# EAGLE design sch (EAGLE 8.6.0)
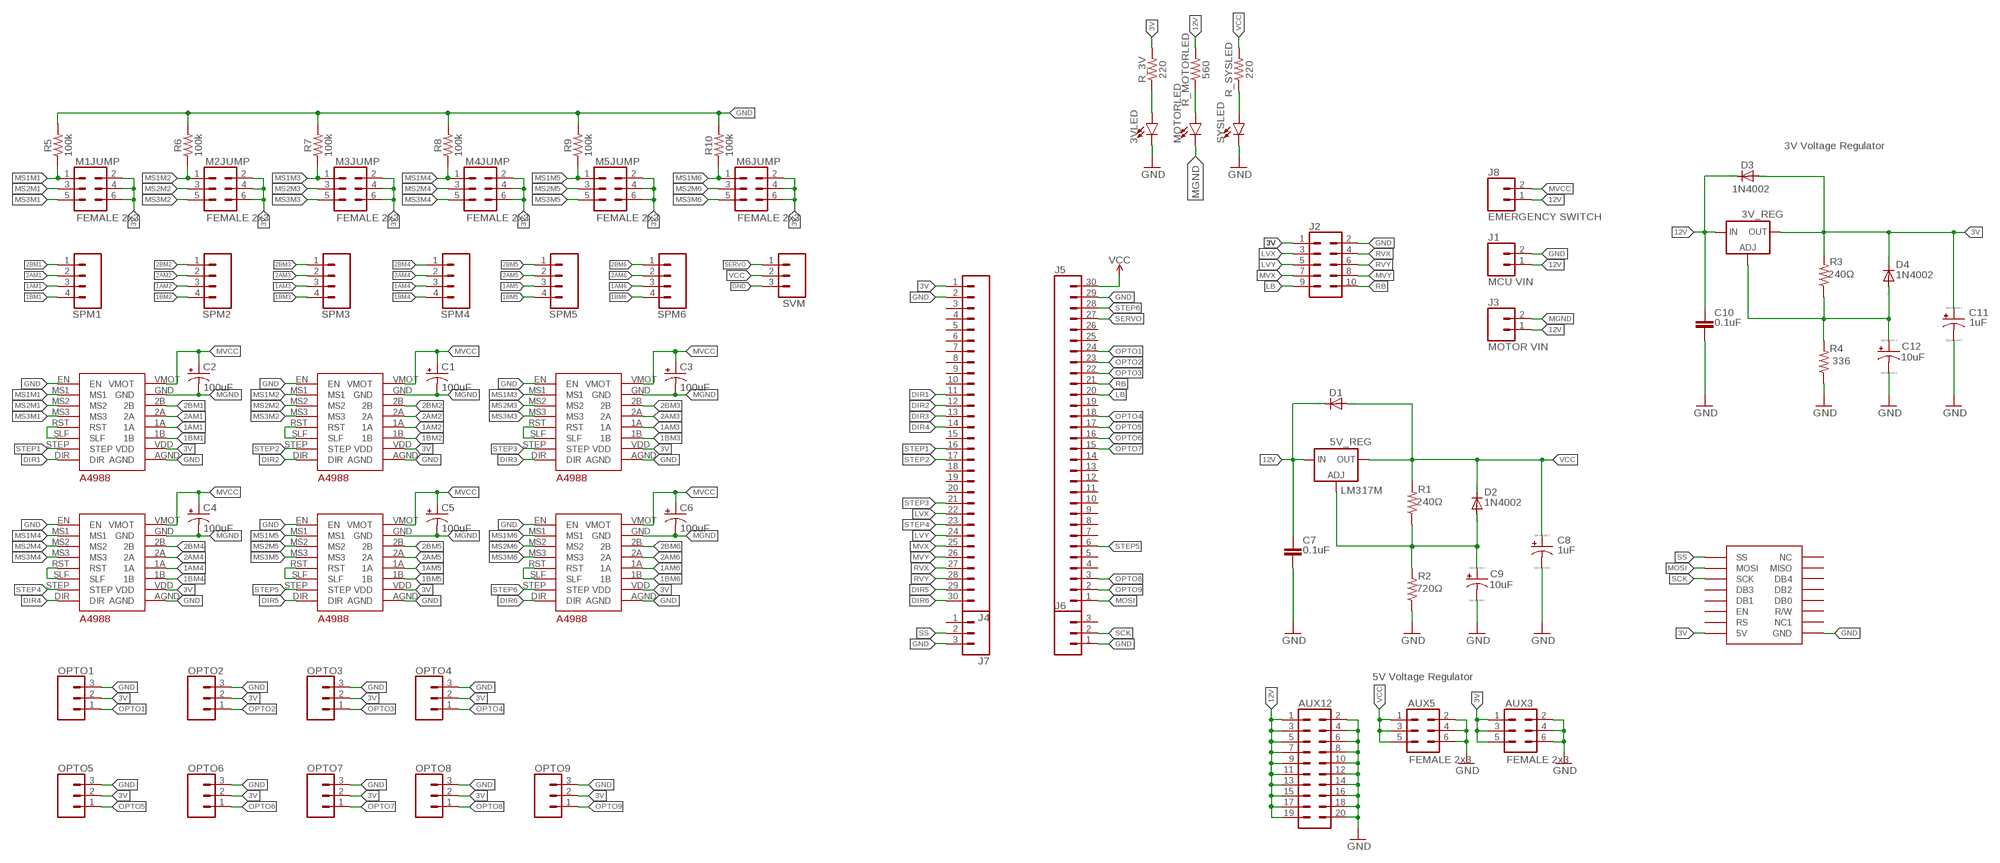
[diagram p0: schematic, sheet 1]

## Parts
3V_REG  LM317MBSTT3  [SOT223]
3VLED  LED1206  [LED-1206]
5V_REG  LM317MBSTT3  [SOT223]
AUX3  FEMALE 2x3  CONN_03X2FEMALE  [2X3]
AUX5  FEMALE 2x3  CONN_03X2FEMALE  [2X3]
AUX12  CONN_10X2  [2X10]
C1  100uF  100UF-POLAR-RADIAL-2.5MM-25V-20%  [CPOL-RADIAL-2.5MM-6.5MM]
C2  100uF  100UF-POLAR-RADIAL-2.5MM-25V-20%  [CPOL-RADIAL-2.5MM-6.5MM]
C3  100uF  100UF-POLAR-RADIAL-2.5MM-25V-20%  [CPOL-RADIAL-2.5MM-6.5MM]
C4  100uF  100UF-POLAR-RADIAL-2.5MM-25V-20%  [CPOL-RADIAL-2.5MM-6.5MM]
C5  100uF  100UF-POLAR-RADIAL-2.5MM-25V-20%  [CPOL-RADIAL-2.5MM-6.5MM]
C6  100uF  100UF-POLAR-RADIAL-2.5MM-25V-20%  [CPOL-RADIAL-2.5MM-6.5MM]
C7  0.1uF  C-EU075-052X106  [C075-052X106]
C8  1uF  CPOL-US085CS-1AR  [085CS_1AR]
C9  10uF  CPOL-US085CS-1AR  [085CS_1AR]
C10  0.1uF  C-EU075-052X106  [C075-052X106]
C11  1uF  CPOL-US085CS-1AR  [085CS_1AR]
C12  10uF  CPOL-US085CS-1AR  [085CS_1AR]
D1  1N4002  1N4004  [DO41-10]
D2  1N4002  1N4004  [DO41-10]
D3  1N4002  1N4004  [DO41-10]
D4  1N4002  1N4004  [DO41-10]
J1  MCU VIN  CONN_023.5MM  [SCREWTERMINAL-3.5MM-2]
J2  CONN_05X2SHD  [2X5-SHROUDED]
J3  MOTOR VIN  CONN_023.5MM  [SCREWTERMINAL-3.5MM-2]
J4  CONN_30  [1X30]
J5  CONN_30  [1X30]
J6  CONN_03  [1X03]
J7  CONN_03  [1X03]
J8  EMERGENCY SWITCH  CONN_023.5MM  [SCREWTERMINAL-3.5MM-2]
M1  A4988_BREAK_OUTTROUGH_HOLE  [A4988_BREAK_OUT]
M1JUMP  FEMALE 2x3  CONN_03X2FEMALE  [2X3]
M2  A4988_BREAK_OUTTROUGH_HOLE  [A4988_BREAK_OUT]
M2JUMP  FEMALE 2x3  CONN_03X2FEMALE  [2X3]
M3  A4988_BREAK_OUTTROUGH_HOLE  [A4988_BREAK_OUT]
M3JUMP  FEMALE 2x3  CONN_03X2FEMALE  [2X3]
M4  A4988_BREAK_OUTTROUGH_HOLE  [A4988_BREAK_OUT]
M4JUMP  FEMALE 2x3  CONN_03X2FEMALE  [2X3]
M5  A4988_BREAK_OUTTROUGH_HOLE  [A4988_BREAK_OUT]
M5JUMP  FEMALE 2x3  CONN_03X2FEMALE  [2X3]
M6  A4988_BREAK_OUTTROUGH_HOLE  [A4988_BREAK_OUT]
M6JUMP  FEMALE 2x3  CONN_03X2FEMALE  [2X3]
MOTORLED  LED1206  [LED-1206]
OPTO1  455-1750-1-ND  CONN_03  [1X03]
OPTO2  455-1750-1-ND  CONN_03  [1X03]
OPTO3  455-1750-1-ND  CONN_03  [1X03]
OPTO4  455-1750-1-ND  CONN_03  [1X03]
OPTO5  455-1750-1-ND  CONN_03  [1X03]
OPTO6  455-1750-1-ND  CONN_03  [1X03]
OPTO7  455-1750-1-ND  CONN_03  [1X03]
OPTO8  455-1750-1-ND  CONN_03  [1X03]
OPTO9  455-1750-1-ND  CONN_03  [1X03]
R1  240Ω  R-US_M0805  [M0805]
R2  720Ω  R-US_M0805  [M0805]
R3  240Ω  R-US_M0805  [M0805]
R4  336  R-US_M0805  [M0805]
R5  100k  100KOHM-0603-1/10W-1%  [0603]
R6  100k  100KOHM-0603-1/10W-1%  [0603]
R7  100k  100KOHM-0603-1/10W-1%  [0603]
R8  100k  100KOHM-0603-1/10W-1%  [0603]
R9  100k  100KOHM-0603-1/10W-1%  [0603]
R10  100k  100KOHM-0603-1/10W-1%  [0603]
R_3V  220  680OHM-0603-1/10W-5%  [0603]
R_MOTORLED  560  680OHM-0603-1/10W-5%  [0603]
R_SYSLED  220  680OHM-0603-1/10W-5%  [0603]
SPM1  CONN_04  [1X04]
SPM2  CONN_04  [1X04]
SPM3  CONN_04  [1X04]
SPM4  CONN_04  [1X04]
SPM5  CONN_04  [1X04]
SPM6  CONN_04  [1X04]
SVM  CONN_03  [1X03]
SYSLED  LED1206  [LED-1206]
U$7  LCD-BREAKOUT  [LCD_BREAKOUT]

## Nets
1AM1 [motor]: M1.1A SPM1.3
1AM2 [motor]: M2.1A SPM2.3
1AM3 [motor]: M3.1A SPM3.3
1AM4 [motor]: M4.1A SPM4.3
1AM5 [motor]: M5.1A SPM5.3
1AM6 [motor]: M6.1A SPM6.3
1BM1 [motor]: M1.1B SPM1.4
1BM2 [motor]: M2.1B SPM2.4
1BM3 [motor]: M3.1B SPM3.4
1BM4 [motor]: M4.1B SPM4.4
1BM5 [motor]: M5.1B SPM5.4
1BM6 [motor]: M6.1B SPM6.4
2AM1 [motor]: M1.2A SPM1.2
2AM2 [motor]: M2.2A SPM2.2
2AM3 [motor]: M3.2A SPM3.2
2AM4 [motor]: M4.2A SPM4.2
2AM5 [motor]: M5.2A SPM5.2
2AM6 [motor]: M6.2A SPM6.2
2BM1 [motor]: M1.2B SPM1.1
2BM2 [motor]: M2.2B SPM2.1
2BM3 [motor]: M3.2B SPM3.1
2BM4 [motor]: M4.2B SPM4.1
2BM5 [motor]: M5.2B SPM5.1
2BM6 [motor]: M6.2B SPM6.1
3V: 3V_REG.4(OUT) AUX3.1 AUX3.3 AUX3.5 C11.+ D3.A D4.C J2.1 J4.1 M1.VDD M1JUMP.2 M1JUMP.4 M1JUMP.6 M2.VDD M2JUMP.2 M2JUMP.4 M2JUMP.6 M3.VDD M3JUMP.2 M3JUMP.4 M3JUMP.6 M4.VDD M4JUMP.2 M4JUMP.4 M4JUMP.6 M5.VDD M5JUMP.2 M5JUMP.4 M5JUMP.6 M6.VDD M6JUMP.2 M6JUMP.4 M6JUMP.6 OPTO1.2 OPTO2.2 OPTO3.2 OPTO4.2 OPTO5.2 OPTO6.2 OPTO7.2 OPTO8.2 OPTO9.2 R3.2 R_3V.2 U$7.P$2(5V)
12V [motor]: 3V_REG.3(IN) 5V_REG.3(IN) AUX12.1 AUX12.3 AUX12.5 AUX12.7 AUX12.9 AUX12.11 AUX12.13 AUX12.15 AUX12.17 AUX12.19 C7.1 C10.1 D1.C D3.C J1.1 J3.1 J8.1 R_MOTORLED.2
DIR1: J4.11 M1.DIR
DIR2: J4.12 M2.DIR
DIR3: J4.13 M3.DIR
DIR4: J4.14 M4.DIR
DIR5: J4.29 M5.DIR
DIR6: J4.30 M6.DIR
GND: 3VLED.C AUX3.2 AUX3.4 AUX3.6 AUX5.2 AUX5.4 AUX5.6 AUX12.2 AUX12.4 AUX12.6 AUX12.8 AUX12.10 AUX12.12 AUX12.14 AUX12.16 AUX12.18 AUX12.20 C7.2 C8.- C9.- C10.2 C11.- C12.- J1.2 J2.2 J4.2 J5.29 J6.1 J7.3 M1.AGND M1.EN M2.AGND M2.EN M3.AGND M3.EN M4.AGND M4.EN M5.AGND M5.EN M6.AGND M6.EN OPTO1.3 OPTO2.3 OPTO3.3 OPTO4.3 OPTO5.3 OPTO6.3 OPTO7.3 OPTO8.3 OPTO9.3 R2.1 R4.1 R5.2 R6.2 R7.2 R8.2 R9.2 R10.2 SVM.3 SYSLED.C U$7.P$1(GND)
LB: J2.9 J5.20
LVX: J2.3 J4.22
LVY: J2.5 J4.24
MGND [motor]: C1.2(-) C2.2(-) C3.2(-) C4.2(-) C5.2(-) C6.2(-) J3.2 M1.GND M2.GND M3.GND M4.GND M5.GND M6.GND MOTORLED.C
MOSI: J5.1 U$7.P$14(MOSI)
MS1M1: M1.MS1 M1JUMP.1 R5.1
MS1M2: M2.MS1 M2JUMP.1 R6.1
MS1M3: M3.MS1 M3JUMP.1 R7.1
MS1M4: M4.MS1 M4JUMP.1 R8.1
MS1M5: M5.MS1 M5JUMP.1 R9.1
MS1M6: M6.MS1 M6JUMP.1 R10.1
MS2M1: M1.MS2 M1JUMP.3
MS2M2: M2.MS2 M2JUMP.3
MS2M3: M3.MS2 M3JUMP.3
MS2M4: M4.MS2 M4JUMP.3
MS2M5: M5.MS2 M5JUMP.3
MS2M6: M6.MS2 M6JUMP.3
MS3M1: M1.MS3 M1JUMP.5
MS3M2: M2.MS3 M2JUMP.5
MS3M3: M3.MS3 M3JUMP.5
MS3M4: M4.MS3 M4JUMP.5
MS3M5: M5.MS3 M5JUMP.5
MS3M6: M6.MS3 M6JUMP.5
MVCC [motor]: C1.1(+) C2.1(+) C3.1(+) C4.1(+) C5.1(+) C6.1(+) J8.2 M1.VMOT M2.VMOT M3.VMOT M4.VMOT M5.VMOT M6.VMOT
MVX: J2.7 J4.25
MVY: J2.8 J4.26
N$1: M2.RST M2.SLF
N$2: M3.RST M3.SLF
N$3: M4.RST M4.SLF
N$4: M5.RST M5.SLF
N$5: M6.RST M6.SLF
N$6: M1.RST M1.SLF
N$7: 5V_REG.1(ADJ) C9.+ D2.A R1.1 R2.2
N$8: 3V_REG.1(ADJ) C12.+ D4.A R3.1 R4.2
N$9: 3VLED.A R_3V.1
N$10: MOTORLED.A R_MOTORLED.1
N$11: R_SYSLED.1 SYSLED.A
OPTO1: J5.24 OPTO1.1
OPTO2: J5.23 OPTO2.1
OPTO3: J5.22 OPTO3.1
OPTO4: J5.18 OPTO4.1
OPTO5: J5.17 OPTO5.1
OPTO6: J5.16 OPTO6.1
OPTO7: J5.15 OPTO7.1
OPTO8: J5.3 OPTO8.1
OPTO9: J5.2 OPTO9.1
RB: J2.10 J5.21
RVX: J2.4 J4.27
RVY: J2.6 J4.28
SCK: J6.2 U$7.P$12(SCK)
SERVO: J5.27 SVM.1
SS: J7.2 U$7.P$16(SS)
STEP1: J4.16 M1.STEP
STEP2: J4.17 M2.STEP
STEP3: J4.21 M3.STEP
STEP4: J4.23 M4.STEP
STEP5: J5.6 M5.STEP
STEP6: J5.28 M6.STEP
VCC: 5V_REG.4(OUT) AUX5.1 AUX5.3 AUX5.5 C8.+ D1.A D2.C J5.30 R1.2 R_SYSLED.2 SVM.2
Unconnected: J4.3 J4.4 J4.5 J4.6 J4.7 J4.8 J4.9 J4.10 J4.15 J4.18 J4.19 J4.20 J5.4 J5.5 J5.7 J5.8 J5.9 J5.10 J5.11 J5.12 J5.13 J5.14 J5.19 J5.25 J5.26 J6.3 J7.1 U$7.P$3(NC1) U$7.P$4(RS) U$7.P$5(R/W) U$7.P$6(EN) U$7.P$7(DB0) U$7.P$8(DB1) U$7.P$9(DB2) U$7.P$10(DB3) U$7.P$11(DB4) U$7.P$13(MISO) U$7.P$15(NC)

## Notes on the sheet
- 3V Voltage Regulator
- 5V Voltage Regulator

## Library data of the parts
3V_REG 5V_REG = v-reg:LM317?*: 500 mA Adjustable Output Positive Voltage Regulator Source: http://www.onsemi.co.jp .. LM317M-D.PDF; PARTNUMBER: LM317M
3VLED MOTORLED SYSLED = SparkFun-LED:LED: LED (Generic) Standard schematic elements and footprints for 5mm, 3mm, 1206, and 0603 sized LEDs. Generic LEDs with no color specified.
AUX3 AUX5 M1JUMP M2JUMP M3JUMP M4JUMP M5JUMP M6JUMP = SparkFun-Connectors:CONN_03X2: Multi connection point. Often used as Generic Header-pin footprint for 0.1 inch spaced/style header connections You can populate with any combo of single row headers, but if you'd like an exact match, check these: Header - 2x3 (Male, 0.1") (PRT-12807) Header - 2x3 (Female, 0.1") (PRT-13010) 2x3 Pin Shrouded Header (PRT-10877) On any of the 0.1 inch spaced packages, you can populate with these: Break Away Headers - Straight (PRT-00116) Break Away Male Headers - Right Angle (PRT-00553) Female Headers (PRT-00115) Break Away Headers - Machine Pin (PRT-00117) Break Away Female Headers - Swiss Machine Pin (PRT-00743) Special note: the shrouded connector mates well with our 3x2 ribbon cables: Ribbon Crimp Connector - 6-pin (2x3, Female) (PRT-10651) Ribbon Cable - 6 wire (15ft) (PRT-10646); PROD_ID: CONN-11566
AUX12 = SparkFun-Connectors:CONN_10X2: Multi connection point. Often used as Generic Header-pin footprint for 0.1 inch spaced/style header connections On any of the 0.1 inch spaced packages, you can populate with these: Break Away Headers - Straight (PRT-00116) Break Away Male Headers - Right Angle (PRT-00553) Female Headers (PRT-00115) Break Away Headers - Machine Pin (PRT-00117) Break Away Female Headers - Swiss Machine Pin (PRT-00743) Special note about the "SPECIAL" package: This was SPECIALLY designed to be used with our Graphic LCD Backpack. Be sure you want to use this! It is not only staggered on each line of header holes, but IT IS ALSO offset of the center point of the top and bottom lines by 5 mil. This causes the headers to lock into place on the "standard" footprint on the LCD screen. The extra squares on the tdocu layer are there simply to reference other pins (if you were to actually populate a longer header than ten long - this is what we do with the backpacks).
C1-C6 = SparkFun-Capacitors:100UF-POLAR: 100µF polarized capacitors A capacitor is a passive two-terminal electrical component used to store electrical energy temporarily in an electric field.; PROD_ID: CAP-08439
C7 C10 = rcl:C-EU: CAPACITOR, European symbol
C8 C9 C11 C12 = resistor:CPOL-US: POLARIZED CAPACITOR, American symbol
D1-D4 = diode:1N4004: DIODE general purpose rectifier, 1 A
J1 J3 J8 = SparkFun-Connectors:CONN_02: Multi connection point. Often used as Generic Header-pin footprint for 0.1 inch spaced/style header connections On any of the 0.1 inch spaced packages, you can populate with these: Break Away Headers - Straight (PRT-00116) Break Away Male Headers - Right Angle (PRT-00553) Female Headers (PRT-00115) Break Away Headers - Machine Pin (PRT-00117) Break Away Female Headers - Swiss Machine Pin (PRT-00743) For SCREWTERMINALS and SPRING TERMINALS visit here: Screw Terimnals on SparkFun.com (5mm/3.5mm/2.54mm spacing) This device is also useful as a general connection point to wire up your design to another part of your project. Our various solder wires solder well into these plated through hole pads. Hook-Up Wire - Assortment (Stranded, 22 AWG) (PRT-11375) Hook-Up Wire - Assortment (Solid Core, 22 AWG) (PRT-11367) View the entire wire category on our website here Special notes: Molex polarized connector foot print use with: PRT-08233 with associated crimp pins and housings. 2.54_SCREWTERM for use with PRT-10571. 3.5mm Screw Terminal footprints for PRT-08084 5mm Screw Terminal footprints for use with PRT-08432; PROD_ID: CONN-08399
J2 = SparkFun-Connectors:CONN_05X2: Multi connection point. Often used as Generic Header-pin footprint for 0.1 inch spaced/style header connections For AVR SPI programming port, see special device with nice symbol: "AVR_SPI_PROG_5x2.dev" You can populate with any combo of single row headers, but if you'd like an exact match, check these: 2x5 AVR ICSP Male Header (PRT-00778) 2x5 Pin Shrouded Header (PRT-08506) On any of the 0.1 inch spaced packages, you can populate with these: Break Away Headers - Straight (PRT-00116) Break Away Male Headers - Right Angle (PRT-00553) Female Headers (PRT-00115) Break Away Headers - Machine Pin (PRT-00117) Break Away Female Headers - Swiss Machine Pin (PRT-00743) Special note: the shrouded connector mates well with our 5x2 ribbon cables: 2x5 Pin IDC Ribbon Cable (PRT-08535); PROD_ID: CONN-08671; SF_ID: PRT-08506
J4 J5 = SparkFun-Connectors:CONN_30: Multi connection point. Often used as Generic Header-pin footprint for 0.1 inch spaced/style header connections On any of the 0.1 inch spaced packages, you can populate with these: Break Away Headers - Straight (PRT-00116) Break Away Male Headers - Right Angle (PRT-00553) Female Headers (PRT-00115) Break Away Headers - Machine Pin (PRT-00117) Break Away Female Headers - Swiss Machine Pin (PRT-00743) For SCREWTERMINALS and SPRING TERMINALS visit here: Screw Terimnals on SparkFun.com (5mm/3.5mm/2.54mm spacing) This device is also useful as a general connection point to wire up your design to another part of your project. Our various solder wires solder well into these plated through hole pads. Hook-Up Wire - Assortment (Stranded, 22 AWG) (PRT-11375) Hook-Up Wire - Assortment (Solid Core, 22 AWG) (PRT-11367) View the entire wire category on our website here Special notes: Molex polarized connector foot print use with SKU : PRT-08231 with associated crimp pins and housings. 1MM SMD Version SKU: PRT-10208 NOTES ON THE VARIANTS LOCK and LOCK_LONGPADS... This footprint was designed to help hold the alignment of a through-hole component (i.e. 6-pin header) while soldering it into place. You may notice that each hole has been shifted either up or down by 0.005 of an inch from it's more standard position (which is a perfectly straight line). This slight alteration caused the pins (the squares in the middle) to touch the edges of the holes. Because they are alternating, it causes a "brace" to hold the component in place. 0.005 has proven to be the perfect amount of "off-center" position when using our standard breakaway headers. Although looks a little odd when you look at the bare footprint, once you have a header in there, the alteration is very hard to notice. Also,if you push a header all the way into place, it is covered up entirely on the bottom side.
J6 J7 SVM = SparkFun-Connectors:CONN_03: Multi connection point. Often used as Generic Header-pin footprint for 0.1 inch spaced/style header connections On any of the 0.1 inch spaced packages, you can populate with these: Break Away Headers - Straight (PRT-00116) Break Away Male Headers - Right Angle (PRT-00553) Female Headers (PRT-00115) Break Away Headers - Machine Pin (PRT-00117) Break Away Female Headers - Swiss Machine Pin (PRT-00743) Stackable Header - 3 Pin (Female, 0.1") (PRT-13875) For SCREWTERMINALS and SPRING TERMINALS visit here: Screw Terimnals on SparkFun.com (5mm/3.5mm/2.54mm spacing) This device is also useful as a general connection point to wire up your design to another part of your project. Our various solder wires solder well into these plated through hole pads. Hook-Up Wire - Assortment (Stranded, 22 AWG) (PRT-11375) Hook-Up Wire - Assortment (Solid Core, 22 AWG) (PRT-11367) View the entire wire category on our website here Special notes: Molex polarized connector foot print use with SKU : PRT-08232 with associated crimp pins and housings.
M1-M6 = KEVIN:A4988_BREAK_OUT
OPTO1-OPTO9 = SparkFun-Connectors:CONN_03: Multi connection point. Often used as Generic Header-pin footprint for 0.1 inch spaced/style header connections On any of the 0.1 inch spaced packages, you can populate with these: Break Away Headers - Straight (PRT-00116) Break Away Male Headers - Right Angle (PRT-00553) Female Headers (PRT-00115) Break Away Headers - Machine Pin (PRT-00117) Break Away Female Headers - Swiss Machine Pin (PRT-00743) Stackable Header - 3 Pin (Female, 0.1") (PRT-13875) For SCREWTERMINALS and SPRING TERMINALS visit here: Screw Terimnals on SparkFun.com (5mm/3.5mm/2.54mm spacing) This device is also useful as a general connection point to wire up your design to another part of your project. Our various solder wires solder well into these plated through hole pads. Hook-Up Wire - Assortment (Stranded, 22 AWG) (PRT-11375) Hook-Up Wire - Assortment (Solid Core, 22 AWG) (PRT-11367) View the entire wire category on our website here Special notes: Molex polarized connector foot print use with SKU : PRT-08232 with associated crimp pins and housings.; PROD_ID: XXX-00000
R1-R4 = resistor:R-US_: RESISTOR, American symbol
R5-R10 = SparkFun-Resistors:100KOHM: 100kΩ resistor A resistor is a passive two-terminal electrical component that implements electrical resistance as a circuit element. Resistors act to reduce current flow, and, at the same time, act to lower voltage levels within circuits. - Wikipedia; PROD_ID: RES-07828
R_3V R_MOTORLED R_SYSLED = SparkFun-Resistors:680OHM: 680Ω resistor A resistor is a passive two-terminal electrical component that implements electrical resistance as a circuit element. Resistors act to reduce current flow, and, at the same time, act to lower voltage levels within circuits. - Wikipedia; PROD_ID: RES-09333; VALUE: 680
SPM1-SPM6 = SparkFun-Connectors:CONN_04: Multi connection point. Often used as Generic Header-pin footprint for 0.1 inch spaced/style header connections On any of the 0.1 inch spaced packages, you can populate with these: Break Away Headers - Straight (PRT-00116) Break Away Male Headers - Right Angle (PRT-00553) Female Headers (PRT-00115) Break Away Headers - Machine Pin (PRT-00117) Break Away Female Headers - Swiss Machine Pin (PRT-00743) For SCREWTERMINALS and SPRING TERMINALS visit here: Screw Terimnals on SparkFun.com (5mm/3.5mm/2.54mm spacing) This device is also useful as a general connection point to wire up your design to another part of your project. Our various solder wires solder well into these plated through hole pads. Hook-Up Wire - Assortment (Stranded, 22 AWG) (PRT-11375) Hook-Up Wire - Assortment (Solid Core, 22 AWG) (PRT-11367) View the entire wire category on our website here Special notes: Molex polarized connector foot print use with SKU : PRT-08231 with associated crimp pins and housings. 1MM SMD Version SKU: PRT-10208; PROD_ID: CONN-09696
U$7 = KEVIN:LCD-BREAKOUT

## Net classes
0 default: width 0.254 mm, drill 0.254 mm, clearance 0.254 mm
1 motor: width 0.635 mm, drill 0.381 mm, clearance 0.508 mm

## Board
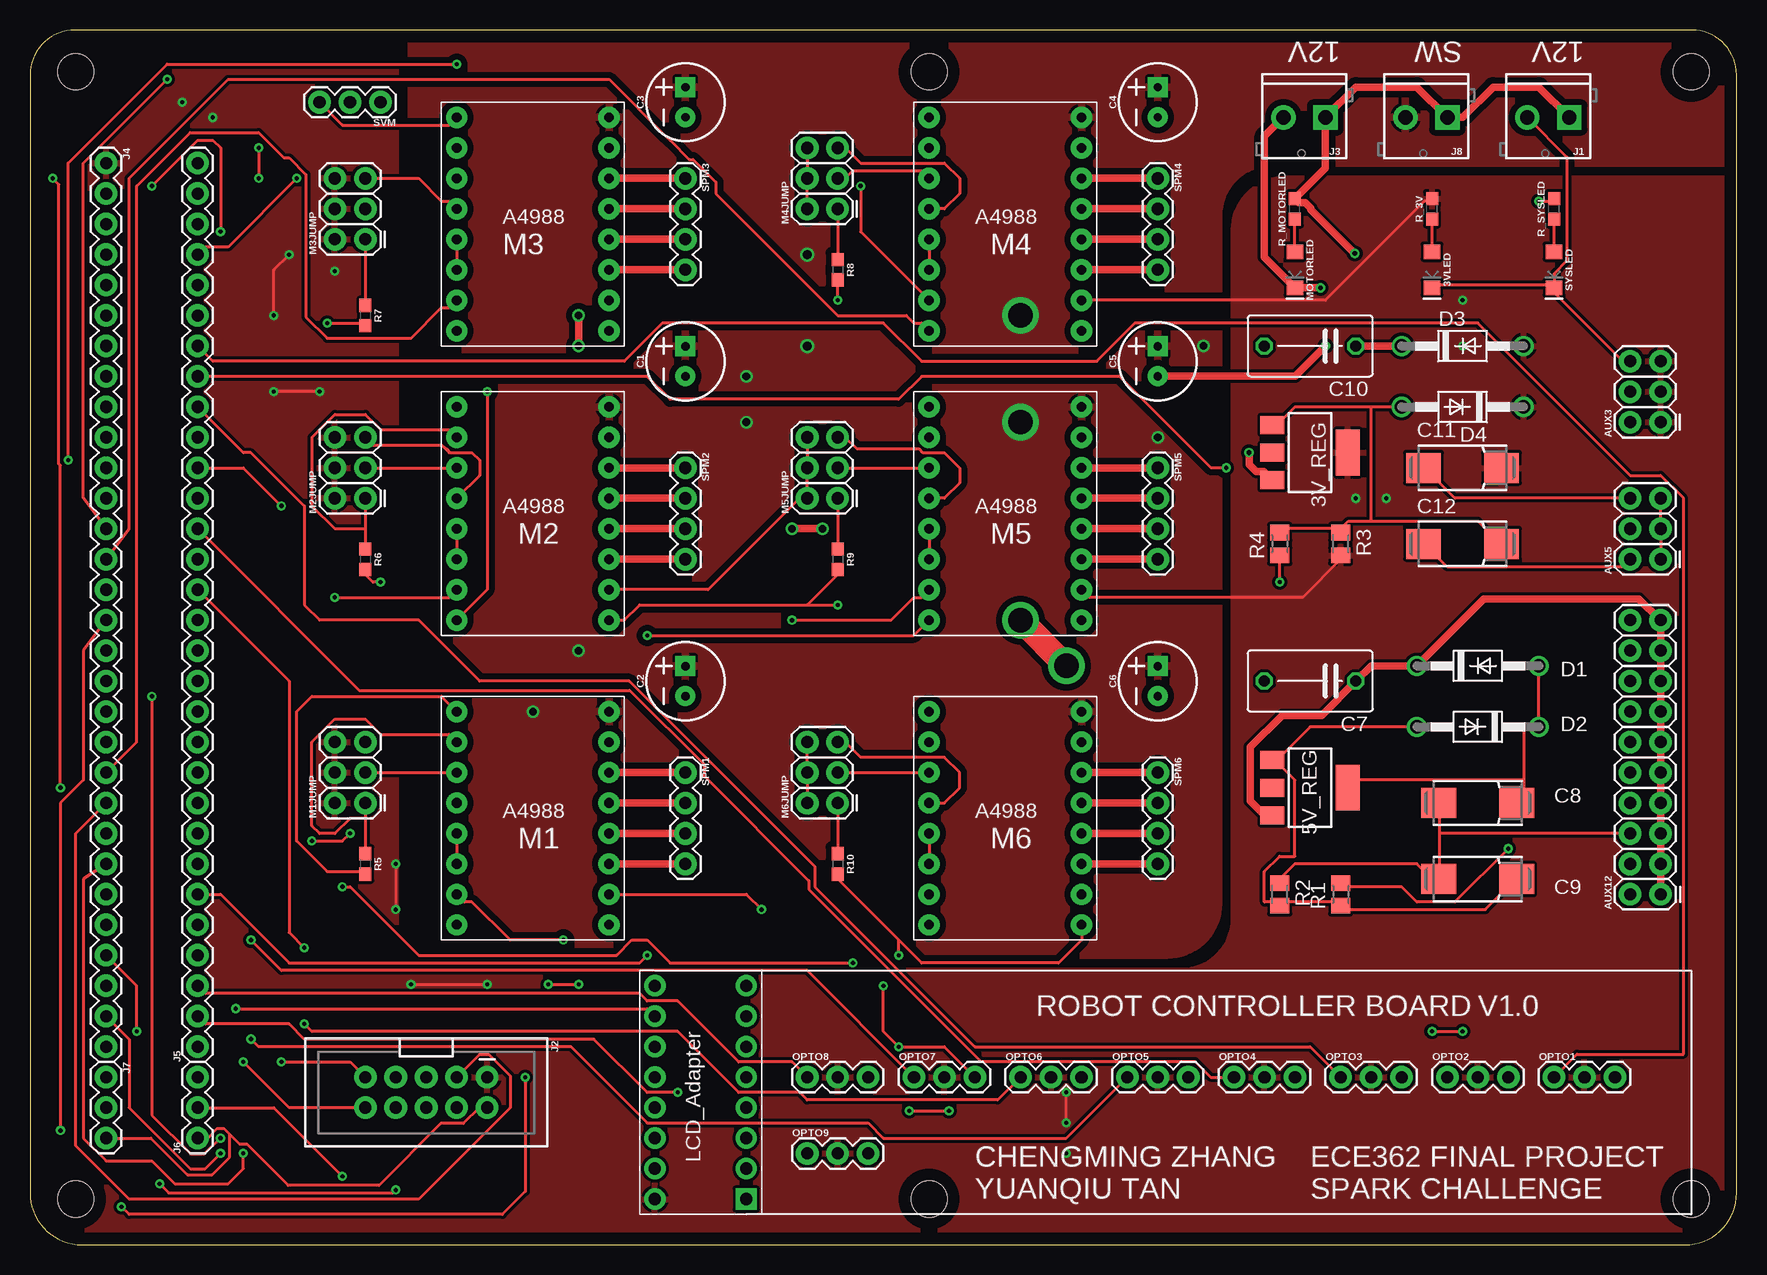
[diagram p1: board, top side]
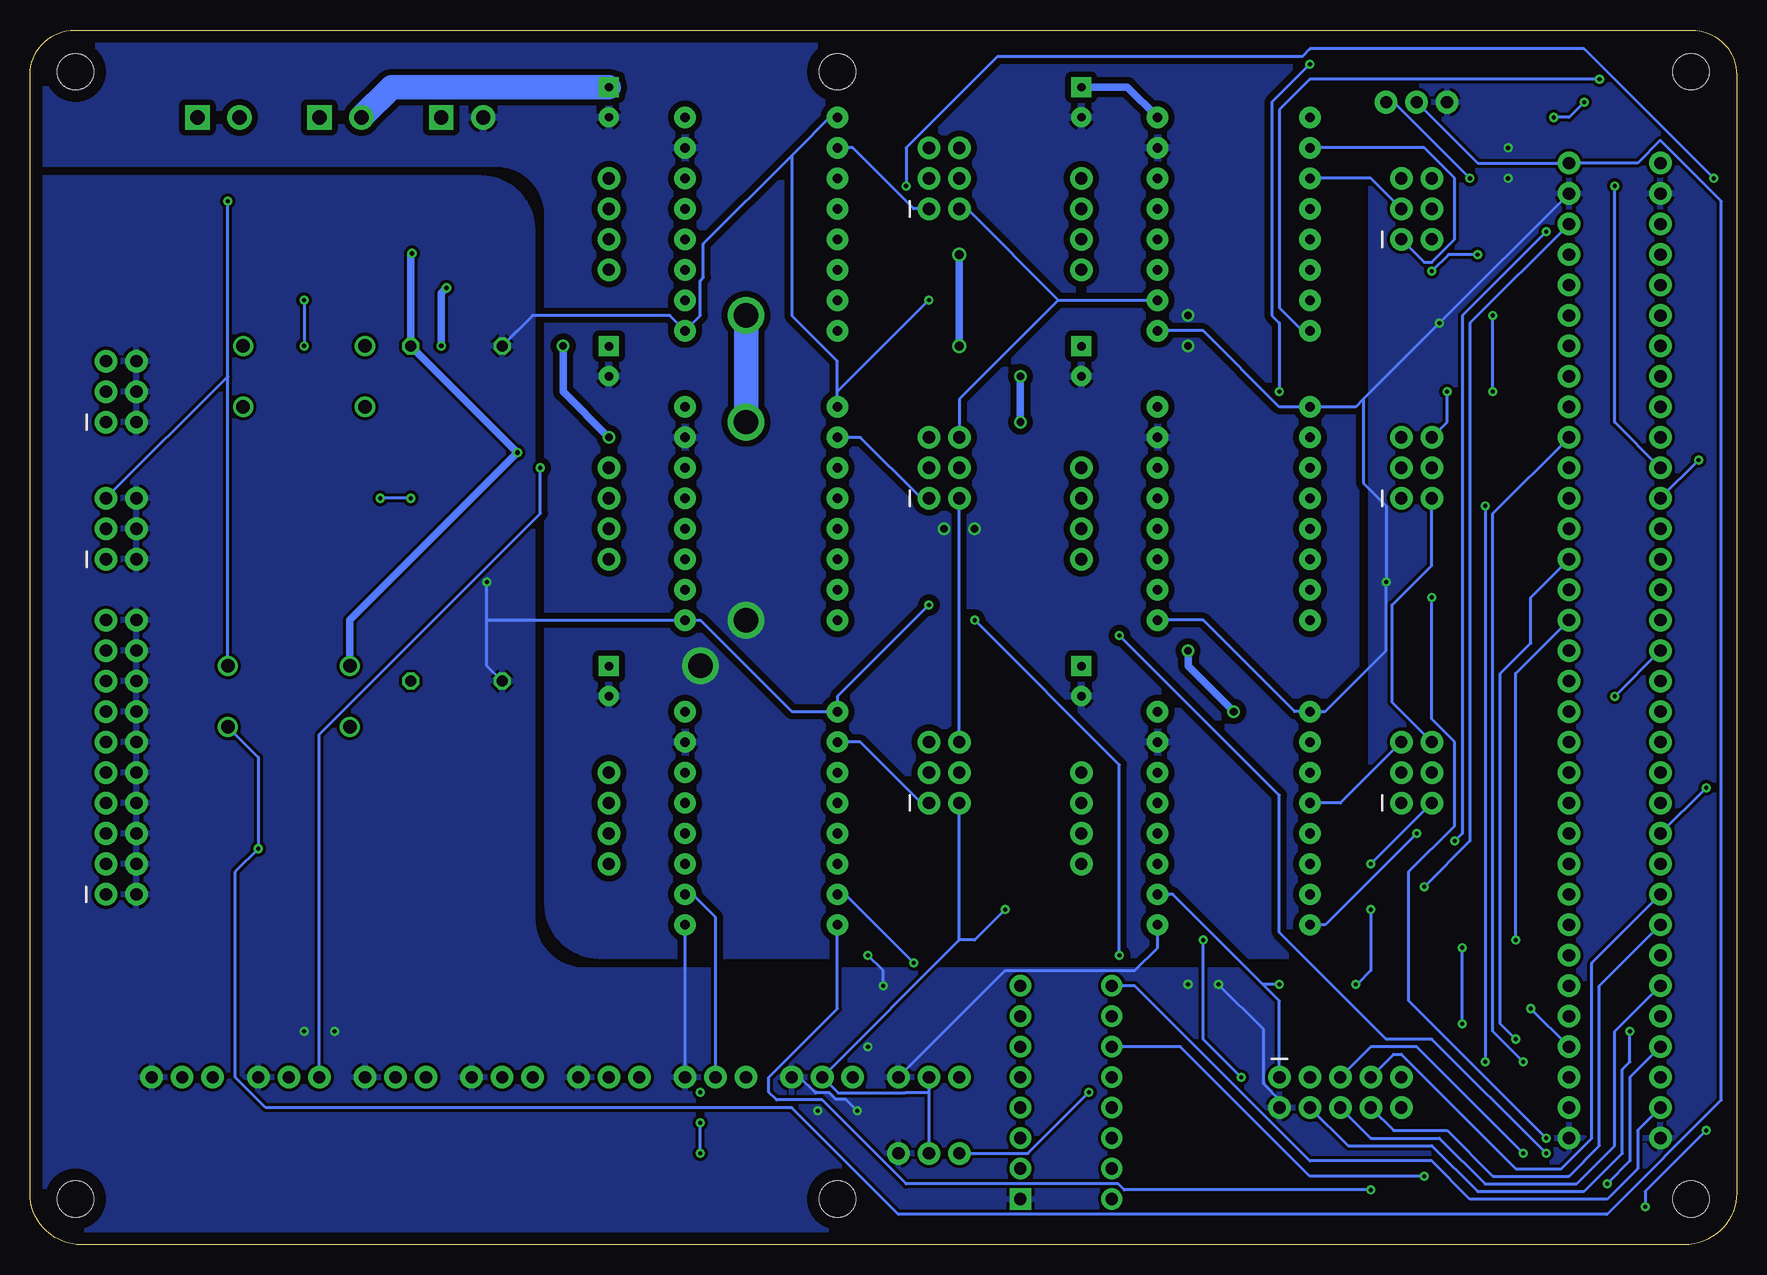
[diagram p2: board, bottom side, seen from below]

Size 142.22 x 101.27 mm. Coordinates in mm from the lower left corner, seen from the top.
Outline: 0,97.52 0,4.34 arc90 4.34,0 137.92,0 arc90 142.22,4.3 142.22,97.55 arc90 138.5,101.27 3.75,101.27 arc90 0,97.52
Copper layers (1*16): Top 0.035mm / dielectric 1.5mm / Bottom 0.035mm
Design rules "default": minimum track width 6mil, minimum drill 0.35mm, track to track 6mil, track to pad 6mil, pad to pad 6mil, via to via 6mil, smd to smd 6mil, copper to edge 40mil, drill to drill 6mil, minimum pad ring 10mil, minimum via ring 8mil, stop-mask expansion 4mil, vias tented up to drill 0mil, thermal gap 10mil
Holes 3 mm at 3.81,97.79 3.81,3.81 138.43,3.81 138.43,97.79 74.93,3.81 74.93,97.79

### Footprints (pad centres in the part's own frame; a part is rotated, then mirrored left to right if it is on the bottom)
SOT223 = smd 1.5 x 2: 1 -2.3,-3.15; 2 0,-3.15; 3 2.3,-3.15 | smd 3.8 x 2: 4 0,3.15
LED-1206 = smd 1.2 x 1.4: A -1.5,0; C 1.5,0
2X3 = drill 1.016 pad 1.88: 1 0,0; 2 0,2.54; 3 2.54,0; 4 2.54,2.54; 5 5.08,0; 6 5.08,2.54
2X10 = drill 1.016 pad 1.88: 1 0,0; 2 0,2.54; 3 2.54,0; 4 2.54,2.54; 5 5.08,0; 6 5.08,2.54; 7 7.62,0; 8 7.62,2.54; 9 10.16,0; 10 10.16,2.54; 11 12.7,0; 12 12.7,2.54; 13 15.24,0; 14 15.24,2.54; 15 17.78,0; 16 17.78,2.54; 17 20.32,0; 18 20.32,2.54; 19 22.86,0; 20 22.86,2.54
CPOL-RADIAL-2.5MM-6.5MM = drill 0.7 pad 1.651 square: 1 1.25,0 | drill 0.7 pad 1.651: 2 -1.25,0
C075-052X106 = drill 0.914 octagon: 1 -3.81,0; 2 3.81,0
085CS_1AR = smd 2.9 x 2.5: + 3.25,0; - -3.25,0
DO41-10 = drill 1.118: A 5.08,0; C -5.08,0
SCREWTERMINAL-3.5MM-2 = drill 1.2 pad 2.032 square: 1 0,0 | drill 1.2 pad 2.032: 2 3.5,0
2X5-SHROUDED = drill 1.016 pad 1.88: 1 -1.27,5.08; 2 1.27,5.08; 3 -1.27,2.54; 4 1.27,2.54; 5 -1.27,0; 6 1.27,0; 7 -1.27,-2.54; 8 1.27,-2.54; 9 -1.27,-5.08; 10 1.27,-5.08
1X30 = drill 1.016 pad 1.88: 1 0,0; 2 2.54,0; 3 5.08,0; 4 7.62,0; 5 10.16,0; 6 12.7,0; 7 15.24,0; 8 17.78,0; 9 20.32,0; 10 22.86,0; 11 25.4,0; 12 27.94,0; 13 30.48,0; 14 33.02,0; 15 35.56,0; 16 38.1,0; 17 40.64,0; 18 43.18,0; 19 45.72,0; 20 48.26,0; 21 50.8,0; 22 53.34,0; 23 55.88,0; 24 58.42,0; 25 60.96,0; 26 63.5,0; 27 66.04,0; 28 68.58,0; 29 71.12,0; 30 73.66,0
1X03 = drill 1.016 pad 1.88: 1 0,0; 2 2.54,0; 3 5.08,0
A4988_BREAK_OUT = drill 0.8 pad 1.778: 1A 13.97,8.89; 1B 13.97,6.35; 2A 13.97,11.43; 2B 13.97,13.97; AGND 13.97,1.27; DIR 1.27,1.27; EN 1.27,19.05; GND 13.97,16.51; MS1 1.27,16.51; MS2 1.27,13.97; MS3 1.27,11.43; RST 1.27,8.89; SLF 1.27,6.35; STEP 1.27,3.81; VDD 13.97,3.81; VMOT 13.97,19.05
M0805 = smd 1.3 x 1.6: 1 -0.95,0; 2 0.95,0
0603 = smd 1.1 x 1: 1 -0.85,0; 2 0.85,0
1X04 = drill 1.016 pad 1.88: 1 0,0; 2 2.54,0; 3 5.08,0; 4 7.62,0
LCD_BREAKOUT = drill 1.016 pad 1.778 square: P$1 5.08,0 | drill 1.016 pad 1.778: P$2 -2.54,0; P$3 5.08,2.54; P$4 -2.54,2.54; P$5 5.08,5.08; P$6 -2.54,5.08; P$7 5.08,7.62; P$8 -2.54,7.62; P$9 5.08,10.16; P$10 -2.54,10.16; P$11 5.08,12.7; P$12 -2.54,12.7; P$13 5.08,15.24; P$14 -2.54,15.24; P$15 5.08,17.78; P$16 -2.54,17.78

### Placement (x,y rotation side)
3V_REG  106.68,66.04 270 top
3VLED  116.84,81.28 270 top
5V_REG  106.68,38.1 270 top
AUX3  135.89,68.58 90 top
AUX5  135.89,57.15 90 top
AUX12  135.89,29.21 90 top
C1  54.61,73.66 90 top
C2  54.61,46.99 90 top
C3  54.61,95.25 90 top
C4  93.98,95.25 90 top
C5  93.98,73.66 90 top
C6  93.98,46.99 90 top
C7  106.68,46.99 180 top
C8  120.65,36.83 0 top
C9  120.65,30.48 0 top
C10  106.68,74.93 180 top
C11  119.38,64.77 0 top
C12  119.38,58.42 0 top
D1  120.65,48.26 0 top
D2  120.65,43.18 180 top
D3  119.38,74.93 0 top
D4  119.38,69.85 180 top
J1  128.27,93.98 180 top
J2  33.02,12.7 270 top
J3  107.95,93.98 180 top
J4  6.35,90.17 270 top
J5  13.97,16.51 90 top
J6  13.97,8.89 90 top
J7  6.35,13.97 270 top
J8  118.11,93.98 180 top
M1  34.29,25.4 0 top
M1JUMP  27.94,36.83 90 top
M2  34.29,50.8 0 top
M2JUMP  27.94,62.23 90 top
M3  34.29,74.93 0 top
M3JUMP  27.94,83.82 90 top
M4  73.66,74.93 0 top
M4JUMP  67.31,86.36 90 top
M5  73.66,50.8 0 top
M5JUMP  67.31,62.23 90 top
M6  73.66,25.4 0 top
M6JUMP  67.31,36.83 90 top
MOTORLED  105.41,81.28 270 top
OPTO1  127,13.97 0 top
OPTO2  118.11,13.97 0 top
OPTO3  109.22,13.97 0 top
OPTO4  100.33,13.97 0 top
OPTO5  91.44,13.97 0 top
OPTO6  82.55,13.97 0 top
OPTO7  73.66,13.97 0 top
OPTO8  64.77,13.97 0 top
OPTO9  64.77,7.62 0 top
R1  109.22,29.21 90 top
R2  104.14,29.21 270 top
R3  109.22,58.42 270 top
R4  104.14,58.42 90 top
R5  27.94,31.75 270 top
R6  27.94,57.15 270 top
R7  27.94,77.47 270 top
R8  67.31,81.28 270 top
R9  67.31,57.15 270 top
R10  67.31,31.75 270 top
R_3V  116.84,86.36 90 top
R_MOTORLED  105.41,86.36 90 top
R_SYSLED  127,86.36 90 top
SPM1  54.61,39.37 270 top
SPM2  54.61,64.77 270 top
SPM3  54.61,88.9 270 top
SPM4  93.98,88.9 270 top
SPM5  93.98,64.77 270 top
SPM6  93.98,39.37 270 top
SVM  29.21,95.25 180 top
SYSLED  127,81.28 270 top
U$7  54.61,3.81 0 top

### Tracks (layer width: path | path; a pad name or v marks a point on that pad's centre or on a via)
1AM1
  Top 0.635: SPM1.3 M1.1A
1AM2
  Top 0.635: SPM2.3 M2.1A
1AM3
  Top 0.635: SPM3.3 M3.1A
1AM4
  Top 0.635: SPM4.3 M4.1A
1AM5
  Top 0.635: SPM5.3 M5.1A
1AM6
  Top 0.635: SPM6.3 M6.1A
1BM1
  Top 0.635: SPM1.4 M1.1B
1BM2
  Top 0.635: SPM2.4 M2.1B
1BM3
  Top 0.635: SPM3.4 M3.1B
1BM4
  Top 0.635: SPM4.4 M4.1B
1BM5
  Top 0.635: SPM5.4 M5.1B
1BM6
  Top 0.635: SPM6.4 M6.1B
2AM1
  Top 0.635: SPM1.2 M1.2A
2AM2
  Top 0.635: SPM2.2 M2.2A
2AM3
  Top 0.635: SPM3.2 M3.2A
2AM4
  Top 0.635: SPM4.2 M4.2A
2AM5
  Top 0.635: SPM5.2 M5.2A
2AM6
  Top 0.635: SPM6.2 M6.2A
2BM1
  Top 0.635: SPM1.1 M1.2B
2BM2
  Top 0.635: SPM2.1 M2.2B
2BM3
  Top 0.635: SPM3.1 M3.2B
2BM4
  Top 0.635: SPM4.1 M4.2B
2BM5
  Top 0.635: SPM5.1 M5.2B
2BM6
  Top 0.635: SPM6.1 M6.2B
3V  (via drill 0.35)
  Top 0.254: M5JUMP.6 M5JUMP.4 M5JUMP.2 64.13,62.23 56.52,54.61 M2.VDD | M4JUMP.6 M4JUMP.4 M4JUMP.2 | M6JUMP.2 M6JUMP.4 M6JUMP.6 | M5.VDD 88.27,53.98 106.04,53.98 109.22,57.15 R3.2 | M4.VDD 107.95,78.74 116.2,87 116.84,87 R_3V.2 | v30.48,31.75 v30.48,27.94 | v31.75,21.71 v38.1,21.71 | M1.VDD 59.69,29.21 v60.96,27.94 | v86.36,10.16 v86.36,12.7 | v24.13,71.12 v20.32,71.12 | v20.32,77.47 20.32,81.28 v21.59,82.55
  Bottom 0.254: 56.52,78.74 M3.VDD | 56.52,78.74 64.13,86.36 M4JUMP.2 | M5JUMP.6 64.77,70.48 56.52,78.74 | M1.VDD 46.99,29.21 39.49,21.71 | 39.49,21.71 38.1,20.32 J2.1 | M6.VDD 86.99,29.21 85.09,27.3 OPTO6.2 | 64.77,25.4 M6JUMP.2 | 64.77,25.4 OPTO7.2 74.88,12.65 69.3,12.65 69.25,12.7 67.31,12.7 | M6JUMP.6 M5JUMP.2 | M1JUMP.2 v30.48,31.75 | v30.48,27.94 30.48,22.86 31.63,21.71 v31.75,21.71 | v38.1,21.71 39.49,21.71 | v60.96,27.94 63.5,25.4 64.77,25.4 | v119.38,78.74 v119.38,74.93 | v110.49,62.23 v113.03,62.23 | v12.7,95.25 13.97,93.98 v15.24,93.98 | v86.36,7.62 v86.36,10.16 | OPTO8.2 67.31,12.7 | 67.31,12.7 OPTO9.2 | M1JUMP.6 28.7,45.21 28.7,53.34 25.4,56.64 M2JUMP.2 | M2JUMP.6 24.13,68.58 v24.13,71.12 | v20.32,71.12 v20.32,77.47 | v21.59,82.55 24.01,82.55 v25.4,81.16
  pour Top: 30.48,101.6 30.48,22.86 95.99,22.86 arc90 100.33,27.2 100.33,84.56 arc-90 104.67,88.9 142.24,88.9 142.24,1.27 143.51,0 -1.27,-1.27 0,101.6
12V  (via drill 0.38)
  Top 0.635: J1.1 125.73,96.52 121.92,96.52 119.38,93.98 J8.1 115.57,96.52 110.49,96.52 J3.1 107.95,89.75 R_MOTORLED.2 105.73,86.89 106.25,86.89 106.73,86.4 106.73,86.31 v110.4,82.64 | 3V_REG.3 102.81,64.47 102.19,64.47 101.6,65.05 v101.6,66.04 | AUX12.1 AUX12.3 AUX12.5 AUX12.7 AUX12.9 AUX12.11 AUX12.13 AUX12.15 AUX12.17 AUX12.19 135.85,52.07 134.08,53.84 121.14,53.84 D1.C 111.76,48.26 C7.1 107.63,44.13 104.34,44.13 101.7,41.49 101.7,37.01 102.87,35.84 102.87,35.56 103.29,35.56 5V_REG.3 | C10.1 D3.C
  Bottom 0.635: v110.4,82.64 110.49,82.55 C10.1 v101.6,66.04 115.57,52.07 D1.C
DIR1  (via drill 0.35)
  Top 0.254: v26.67,34.29 26.04,33.66 v23.5,33.66 | v10.16,88.27 13.97,92.08 15.24,92.08 15.88,91.44 v15.88,84.45
  Bottom 0.254: M1.DIR 34.29,26.67 v26.67,34.29 | v23.5,33.66 22.86,34.29 22.86,77.47 v15.88,84.45 | v10.16,88.27 10.16,68.58 J4.11
DIR2  (via drill 0.35)
  Top 0.254: M2.DIR 38.1,54.61 v38.1,71.12 | v35.56,98.42 11.43,98.42 3.17,90.17 v3.17,65.41
  Bottom 0.254: v38.1,71.12 38.1,76.83 38.73,77.47 38.73,95.25 v35.56,98.42 | J4.12 v3.17,65.41
DIR3  (via drill 0.35)
  Top 0.254: v11.43,97.16 4.45,90.17 4.45,62.23 J4.13
  Bottom 0.254: M3.DIR 36.2,76.2 38.1,78.11 38.1,94.61 35.56,97.16 v11.43,97.16
DIR4
  Top 0.254: M4.DIR 74.29,76.83 73.66,76.83 73.02,77.47 67.31,77.47 57.15,87.63 57.15,88.59 55.26,90.47 54.94,90.47 53.34,92.08 53.02,92.39 48.26,97.16 16.51,97.16 8.25,88.9 8.25,59.69 J4.14
DIR5  (via drill 0.35)
  Top 0.254: M5.DIR 73.66,50.8 v51.44,50.8 | v15.88,7.62 14.61,6.35 13.34,6.35 8.25,11.43 8.25,17.14 J4.29
  Bottom 0.254: v51.44,50.8 38.1,37.47 38.1,26.04 29.21,17.14 25.4,17.14 v15.88,7.62
DIR6  (via drill 0.35)
  Top 0.254: v10.8,5.08 11.56,4.32 30.23,4.32 v30.48,4.57
  Bottom 0.254: M6.DIR 74.93,19.68 80.64,13.97 80.64,12.7 80.01,12.06 76.2,12.06 69.21,5.08 51.54,5.08 51.03,4.57 v30.48,4.57 | v10.8,5.08 8.89,6.99 8.89,13.97 J4.30
GND  (via drill 0.35)
  Top 0.254: 64.77,53.34 67.31,55.88 R9.2 | 64.77,53.34 50.8,53.34 49.53,52.07 M2.AGND | R5.2 27.94,31.11 24.77,31.11 22.23,33.66 22.23,44.45 23.5,45.72 34.29,45.72 M1.EN | v29.21,55.24 28.57,55.24 27.94,55.88 R6.2 | v67.31,78.74 R8.2 | 72.39,25.4 74.29,23.5 85.72,23.5 87.63,25.4 M6.AGND | 72.39,25.4 67.31,30.48 R10.2 | R2.1 104.14,30.48 105.41,31.75 115.57,31.75 116.84,30.48 C9.- 117.47,30.48 117.47,34.29 | 117.47,34.29 117.47,36.83 C8.- | 3VLED.C 116.84,80.01 127,80.01 SYSLED.C | v24.77,76.83 27.94,76.83 R7.2 | v104.14,55.24 R4.1 | AUX5.2 132.72,56.52 118.11,56.52 116.2,58.42 C12.- | AUX5.6 118.74,62.23 116.2,64.77 C11.- | M3.EN 34.93,93.34 26.04,93.34 SVM.3 | AUX3.6 132.72,73.66 127,79.38 SYSLED.C | AUX12.6 117.47,34.29 | J7.3 10.08,8.89 13.12,5.84 15.17,5.84 16.63,7.31 16.63,9.2 | 16.63,9.2 16.19,9.65 15.56,9.65 14.8,8.89 J6.1 | J2.2 37.43,11.43 36.11,10.11 34.24,10.11 29.09,4.96 21.52,4.96 18.09,8.38 17.46,8.38 16.63,9.2 | v43.18,21.71 v45.72,21.71 | 64.77,53.34 v67.31,53.34 | v19.05,91.44 v19.05,88.9 | v73.28,11.18 v76.58,11.18 | OPTO7.3 76.2,16.51 v72.39,16.51 71.12,17.78 v71.12,21.59 | v72.39,24.13 72.39,25.4 | v116.84,17.78 v119.38,17.78 | SYSLED.C 127,80.94 128.08,82.02 128.08,90.67 J1.2
  Bottom 0.254: M2.AGND 44.45,52.07 36.83,44.45 M1.EN 34.29,44.45 29.21,49.53 v29.21,55.24 29.21,61.59 31.12,63.5 31.12,70.48 | v67.31,78.74 74.93,71.12 M5.EN 74.93,73.66 78.74,77.47 78.74,90.81 | M4.EN 75.56,93.98 78.42,91.12 78.74,90.81 | J5.29 v24.77,76.83 31.12,70.48 | 104.14,52.07 104.14,48.26 C7.2 | 104.14,52.07 v104.14,55.24 | 31.12,70.48 31.75,69.85 M2.EN 38.1,69.85 44.45,76.2 M3.AGND | M1.AGND 48.26,24.77 50.16,22.86 60.96,22.86 OPTO8.3 | 104.14,52.07 M5.AGND 86.36,52.07 78.74,44.45 M6.EN 74.93,45.72 v67.31,53.34 | OPTO6.3 M6.AGND | 101.6,76.2 C10.2 100.33,77.47 88.9,77.47 M4.AGND 86.36,77.47 86.36,80.39 86.11,80.65 86.11,83.44 78.74,90.81 | J2.2 38.1,12.1 39.42,13.42 39.42,17.95 v43.18,21.71 | v45.72,21.71 45.72,21.59 | v73.28,11.18 74.24,12.14 75.09,12.14 75.6,12.65 76.75,12.65 78.07,13.97 OPTO7.3 | v71.12,21.59 71.12,22.86 v72.39,24.13
  pour Bottom: 0,101.6 30.48,101.6 30.48,22.86 95.99,22.86 arc90 100.33,27.2 100.33,84.56 arc-90 104.67,88.9 142.24,88.9 142.24,0 -1.27,-1.27
LB  (via drill 0.35)
  Top 0.254: J2.9 26.67,15.24 v20.96,15.24 | v20.96,61.59 17.78,64.77 J5.20
  Bottom 0.254: v20.96,61.59 v20.96,15.24
LVX
  Top 0.254: J4.22 3.81,34.29 3.81,8.26 8.25,3.81 32.38,3.81 40.01,11.43 40.01,14.1 38.23,15.88 37.47,15.88 J2.3
LVY  (via drill 0.35)
  Top 0.254: J4.24 4.45,30.48 4.45,8.89 6.35,6.99 10.16,6.99 12.07,5.08 16.51,5.08 17.78,6.35 v17.78,7.62
  Bottom 0.254: J2.5 30.48,16.51 26.67,16.51 v17.78,7.62
MGND  (via drill 0.38, 0.64, 2.03)
  Top 0.635: v63.5,59.69 v66.04,59.69 | v45.72,77.47 v45.72,74.93 | C5.2 105.43,72.41 v107.95,74.93 | v107.52,79.77 v107.51,79.78 MOTORLED.C 102.87,82.32 102.87,92.4 J3.2
  Top 2.032: v82.55,52.07 v86.36,48.26
  Bottom 0.635: v107.95,74.93 107.95,79.34 v107.52,79.77
  pour Bottom: 31.75,101.6 31.75,24.13 94.72,24.13 arc90 99.06,28.47 99.06,85.83 arc-90 103.4,90.17 142.24,90.17 142.24,101.6
MOSI  (via drill 0.35)
  Top 0.254: U$7.P$14 51.44,19.68 v17.14,19.68
  Bottom 0.254: J5.1 v17.14,19.68
MS1M1
  Top 0.254: M1JUMP.1 27.94,35.56 | 27.94,35.56 R5.1 | M1.MS1 34.93,42.55 29.21,42.55 27.94,43.81 25.4,43.81 23.5,41.91 23.5,34.92 24.13,34.29 25.4,34.29 26.67,35.56 27.94,35.56
MS1M2
  Top 0.254: M2JUMP.1 27.94,59.69 | 27.94,59.69 R6.1 | M2.MS1 34.93,67.94 29.21,67.94 27.94,69.22 25.4,69.22 23.5,67.31 23.5,61.59 25.4,59.69 27.94,59.69
MS1M3
  Top 0.254: M3JUMP.1 R7.1
  Bottom 0.254: M3.MS1 26.04,91.44 23.5,88.9 23.5,83.82 25.4,81.92 26.04,81.92 M3JUMP.1
MS1M4
  Top 0.254: M4JUMP.1 R8.1
  Bottom 0.254: M4.MS1 73.66,91.44 68.58,86.36 M4JUMP.1
MS1M5
  Top 0.254: M5JUMP.1 R9.1
  Bottom 0.254: M5.MS1 73.02,67.31 67.94,62.23 M5JUMP.1
MS1M6
  Top 0.254: M6JUMP.1 R10.1
  Bottom 0.254: M6.MS1 73.02,41.91 67.94,36.83 M6JUMP.1
MS2M1
  Top 0.254: M1JUMP.3 M1.MS2
MS2M2
  Top 0.254: M2JUMP.3 M2.MS2
MS2M3
  Bottom 0.254: M3.MS2 30.48,88.9 M3JUMP.3
MS2M4
  Top 0.254: M4.MS2 74.29,89.53 68.58,89.53 67.94,88.9 M4JUMP.3
MS2M5
  Top 0.254: M5JUMP.3 M5.MS2
MS2M6
  Top 0.254: M6JUMP.3 M6.MS2
MS3M1
  Bottom 0.254: M1.MS3 33.02,36.83 M1JUMP.5
MS3M2
  Top 0.254: M2.MS3 37.47,64.14 37.47,65.41 36.83,66.04 35.03,66.04 34.72,66.36 34.61,66.36 | 34.61,66.36 34.29,66.67 28.57,66.67 M2JUMP.5 | 34.61,66.36 34.93,66.04
MS3M3
  Top 0.254: M3.MS3 34.93,87 34.29,87 32.38,88.9 M3JUMP.5
MS3M4
  Top 0.254: M4JUMP.5 67.94,91.44 69.21,90.17 76.2,90.17 77.47,88.9 77.47,87.63 76.2,86.36 M4.MS3
MS3M5
  Top 0.254: M5JUMP.5 67.94,67.31 68.9,66.36 74.09,66.36 74.4,66.04 76.2,66.04 77.47,64.77 77.47,63.5 76.2,62.23 M5.MS3
MS3M6
  Top 0.254: M6JUMP.5 67.94,41.91 69.21,40.64 76.2,40.64 77.47,39.37 77.47,38.1 76.2,36.83 M6.MS3
MVCC  (via drill 0.64, 0.76, 2.03)
  Bottom 0.635: v41.91,44.45 45.72,48.26 v45.72,49.53 | M3.VMOT 50.78,96.5 C3.1 | v59.69,72.39 v59.69,68.58 | v64.77,82.55 v64.77,74.93 | v93.98,67.31 97.79,71.12 v97.79,74.93
  Bottom 2.032: C4.1 103.38,96.5 103.4,96.52 112.07,96.52 J8.2 | v82.55,77.47 v82.55,68.58
  pour Top: 31.75,101.6 31.75,24.13 94.72,24.13 arc90 99.06,28.47 99.06,85.83 arc-90 103.4,90.17 142.24,90.17 142.24,101.6
MVX
  Bottom 0.254: J4.25 12.07,23.5 12.07,8.89 14.61,6.35 18.41,6.35 27.94,15.88 28.57,15.88 J2.7
MVY
  Bottom 0.254: J4.26 11.43,21.59 11.43,8.26 13.97,5.71 20.32,5.71 24.13,9.53 28.57,9.53 J2.8
N$1
  Top 0.254: M2.RST M2.SLF
N$2
  Top 0.254: M3.RST M3.SLF
N$3
  Top 0.254: M4.RST M4.SLF
N$4
  Top 0.254: M5.RST M5.SLF
N$5
  Top 0.254: M6.RST M6.SLF
N$6
  Top 0.254: M1.RST M1.SLF
N$7
  Top 0.254: D2.A 106.68,43.18 104.14,40.64 5V_REG.1 104.14,40.01 105.41,38.73 105.41,32.38 104.14,32.38 102.87,31.11 102.87,28.57 104.14,28.57 | 104.14,28.57 109.22,28.57 R1.1 109.22,27.94 121.28,27.94 123.82,30.48 C9.+ | 104.14,28.57 R2.2
N$8
  Top 0.254: D4.A 111.76,69.85 | 111.76,69.85 105.41,69.85 104.14,68.58 3V_REG.1 | 109.22,59.69 104.14,59.69 R4.2 | 111.76,60.33 109.85,60.33 109.22,59.69 | 111.76,60.33 120.65,60.33 122.55,58.42 C12.+ | 109.22,59.69 R3.1 | 111.76,60.33 111.76,69.85
N$9
  Top 0.254: 3VLED.A R_3V.1
N$10
  Top 0.254: MOTORLED.A R_MOTORLED.1
N$11
  Top 0.254: SYSLED.A R_SYSLED.1
OPTO1
  Top 0.254: J5.24 15.24,73.66 49.53,73.66 52.7,76.83 71.12,76.83 74.29,73.66 88.9,73.66 92.07,76.83 120.65,76.83 133.35,64.14 135.89,64.14 137.8,62.23 137.8,15.88 128.91,15.88 OPTO1.1
OPTO2  (via drill 0.35)
  Top 0.254: J5.23 51.44,72.39 53.34,70.48 72.39,70.48 74.29,72.39 90.8,72.39 98.42,64.77 v99.69,64.77
  Bottom 0.254: v99.69,64.77 99.69,60.96 118.11,42.55 OPTO2.1
OPTO3
  Top 0.254: J5.22 17.78,66.04 18.41,66.04 22.86,61.59 22.86,53.34 24.13,52.07 32.38,52.07 37.47,46.99 49.94,46.99 50.8,46.13 51,45.92 65.4,31.52 65.4,29.84 78.74,16.51 106.68,16.51 OPTO3.1
OPTO4
  Top 0.254: J5.18 27.43,46.23 49.98,46.23 56.19,40.02 56.19,39.06 64.9,30.35 64.9,29.64 79.24,15.29 97.07,15.29 98.39,13.97 OPTO4.1
OPTO5  (via drill 0.35)
  Top 0.254: v18.41,17.14 19.05,16.51 45.09,16.51 51.44,10.16 69.85,10.16 71.12,8.89 86.36,8.89 OPTO5.1
  Bottom 0.254: J5.17 17.14,53.98 17.14,50.16 19.69,47.62 19.69,18.41 v18.41,17.14
OPTO6  (via drill 0.35)
  Top 0.254: J5.16 21.59,46.99 21.59,26.04 v22.86,24.77 | v22.86,18.41 23.5,17.78 53.98,17.78 59.05,12.7 64.13,12.7 64.77,12.06 80.64,12.06 OPTO6.1
  Bottom 0.254: v22.86,18.41 v22.86,24.77
OPTO7  (via drill 0.35)
  Top 0.254: v18.41,25.4 20.96,22.86 64.77,22.86 OPTO7.1
  Bottom 0.254: J5.15 18.41,47.62 v18.41,25.4
OPTO8
  Top 0.254: J5.3 14.61,20.95 50.8,20.95 51.44,20.32 53.98,20.32 59.05,15.24 63.5,15.24 OPTO8.1
OPTO9  (via drill 0.35)
  Top 0.254: J5.2 14.61,18.41 21.59,18.41 22.86,17.14 46.99,17.14 51.44,12.7 v53.98,12.7
  Bottom 0.254: v53.98,12.7 59.05,7.62 OPTO9.1
RB  (via drill 0.35)
  Top 0.254: v17.78,15.24 21.59,11.43 J2.10
  Bottom 0.254: J5.21 20.32,60.96 20.32,17.78 v17.78,15.24
RVX  (via drill 0.35)
  Top 0.254: J4.27 8.89,21.59 v8.89,17.78
  Bottom 0.254: v8.89,17.78 8.89,15.24 9.52,14.61 9.52,7.62 12.7,4.45 21.59,4.45 25.4,8.26 32.38,8.26 J2.4
RVY
  Bottom 0.254: J4.28 10.16,17.78 10.16,8.26 13.34,5.08 20.96,5.08 24.77,8.89 30.48,8.89 J2.6
SCK  (via drill 0.35)
  Top 0.254: v26.04,5.71 20.32,11.43 J6.2
  Bottom 0.254: U$7.P$12 46.36,16.51 35.56,5.71 v26.04,5.71
SERVO  (via drill 0.35)
  Top 0.254: J5.27 14.61,83.19 16.51,83.19 v22.23,88.9
  Bottom 0.254: v22.23,88.9 28.57,95.25 SVM.1
SS
  Bottom 0.254: U$7.P$16 50.16,21.59 35.56,6.99 25.4,6.99 22.23,3.81 10.8,3.81 8.25,6.35 8.25,9.53 J7.2
STEP1  (via drill 0.35)
  Top 0.254: M1.STEP 36.2,28.57 36.83,28.57 40.01,25.4 v44.45,25.4 | v2.54,9.53 2.54,36.83 4.45,38.73 4.45,49.53 J4.16 | v41.27,13.97 41.27,4.45 39.37,2.54 8.25,2.54 v7.62,3.17
  Bottom 0.254: v44.45,25.4 44.45,17.14 v41.27,13.97 | v7.62,3.17 7.62,4.45 v2.54,9.53
STEP2  (via drill 0.35)
  Top 0.254: M2.STEP 34.93,53.98 v25.4,53.98 | v10.16,45.72 10.16,10.79 13.39,7.57 14.52,7.57 15.84,8.89 v15.88,8.89
  Bottom 0.254: v15.88,8.89 27.3,20.32 27.3,31.11 23.5,34.92 23.5,41.91 25.4,43.81 v25.4,53.98 | J4.17 v10.16,45.72
STEP3
  Top 0.254: M3.STEP 34.93,78.11 34.29,78.11 31.75,75.56 24.77,75.56 22.98,77.35 22.98,89.21 21.59,90.61 21.15,90.61 19.05,92.71 13.34,92.71 8.89,88.27 8.89,41.91 J4.21
STEP4  (via drill 0.35)
  Top 0.254: v2.54,38.1 2.54,64.97 2.42,65.09 2.42,88.39 v1.91,88.9 | v69.21,88.27 69.21,84.45 M4.STEP
  Bottom 0.254: v69.21,88.27 69.21,91.44 61.6,99.06 36.2,99.06 35.56,99.69 12.7,99.69 v1.91,88.9 | J4.23 v2.54,38.1
STEP5  (via drill 0.35)
  Top 0.254: M5.STEP 74.29,53.98 73.66,53.98 71.75,52.07 v63.5,52.07 | v51.44,24.13 50.8,23.5 21.59,23.5 15.88,29.21 J5.6
  Bottom 0.254: v63.5,52.07 51.44,40.01 v51.44,24.13
STEP6  (via drill 0.35)
  Top 0.254: v68.58,23.5 53.34,23.5 51.44,25.4 50.16,25.4 48.9,24.13 32.38,24.13 26.67,29.84 v26.04,29.84
  Bottom 0.254: M6.STEP 74.29,29.21 v68.58,23.5 | v26.04,29.84 22.23,33.66 22.23,76.83 J5.28
VCC  (via drill 0.35)
  Top 0.254: AUX5.1 AUX5.3 AUX5.5 | v125.73,87 127,87 R_SYSLED.2 | v123.19,33.02 118.74,28.57 115.57,28.57 114.3,29.84 109.22,29.84 R1.2 | 124.46,38.73 124.46,43.18 D2.C D1.A | 124.46,38.73 124.46,36.83 C8.+ | 124.46,38.73 110.49,38.73 109.85,38.1 5V_REG.4
  Bottom 0.254: D1.A 125.73,72.39 | 125.73,72.39 v125.73,87 | 125.73,72.39 AUX5.5 | SVM.2 21.59,90.17 J5.30 8.25,90.17 6.35,92.08 1.27,87 1.27,12.06 10.8,2.54 69.85,2.54 78.74,11.43 122.55,11.43 125.09,13.97 125.09,31.11 v123.19,33.02 123.19,40.64 D2.C

### Text on the board
tPlace: 12V | SW | 12V | M3 | M4 | M2 | M5 | M1 | M6 | ROBOT CONTROLLER BOARD | V1.0 | CHENGMING ZHANG / YUANQIU TAN | ECE362 FINAL PROJECT / SPARK CHALLENGE